# Altium schematic sheet 06 - SAMA7D65-DDR3L.SchDoc
size B; CompanyName: Microchip Technology Inc.; Organization: Microchip Technology; Address1: 2355 West Chandler Blvd.; Address2: Chandler, AZ  85224; Address4: USA; DocumentNumber: 6; SheetNumber: 6; SheetTotal: 15; SheetTitle: SAMA7D65 DDR3L
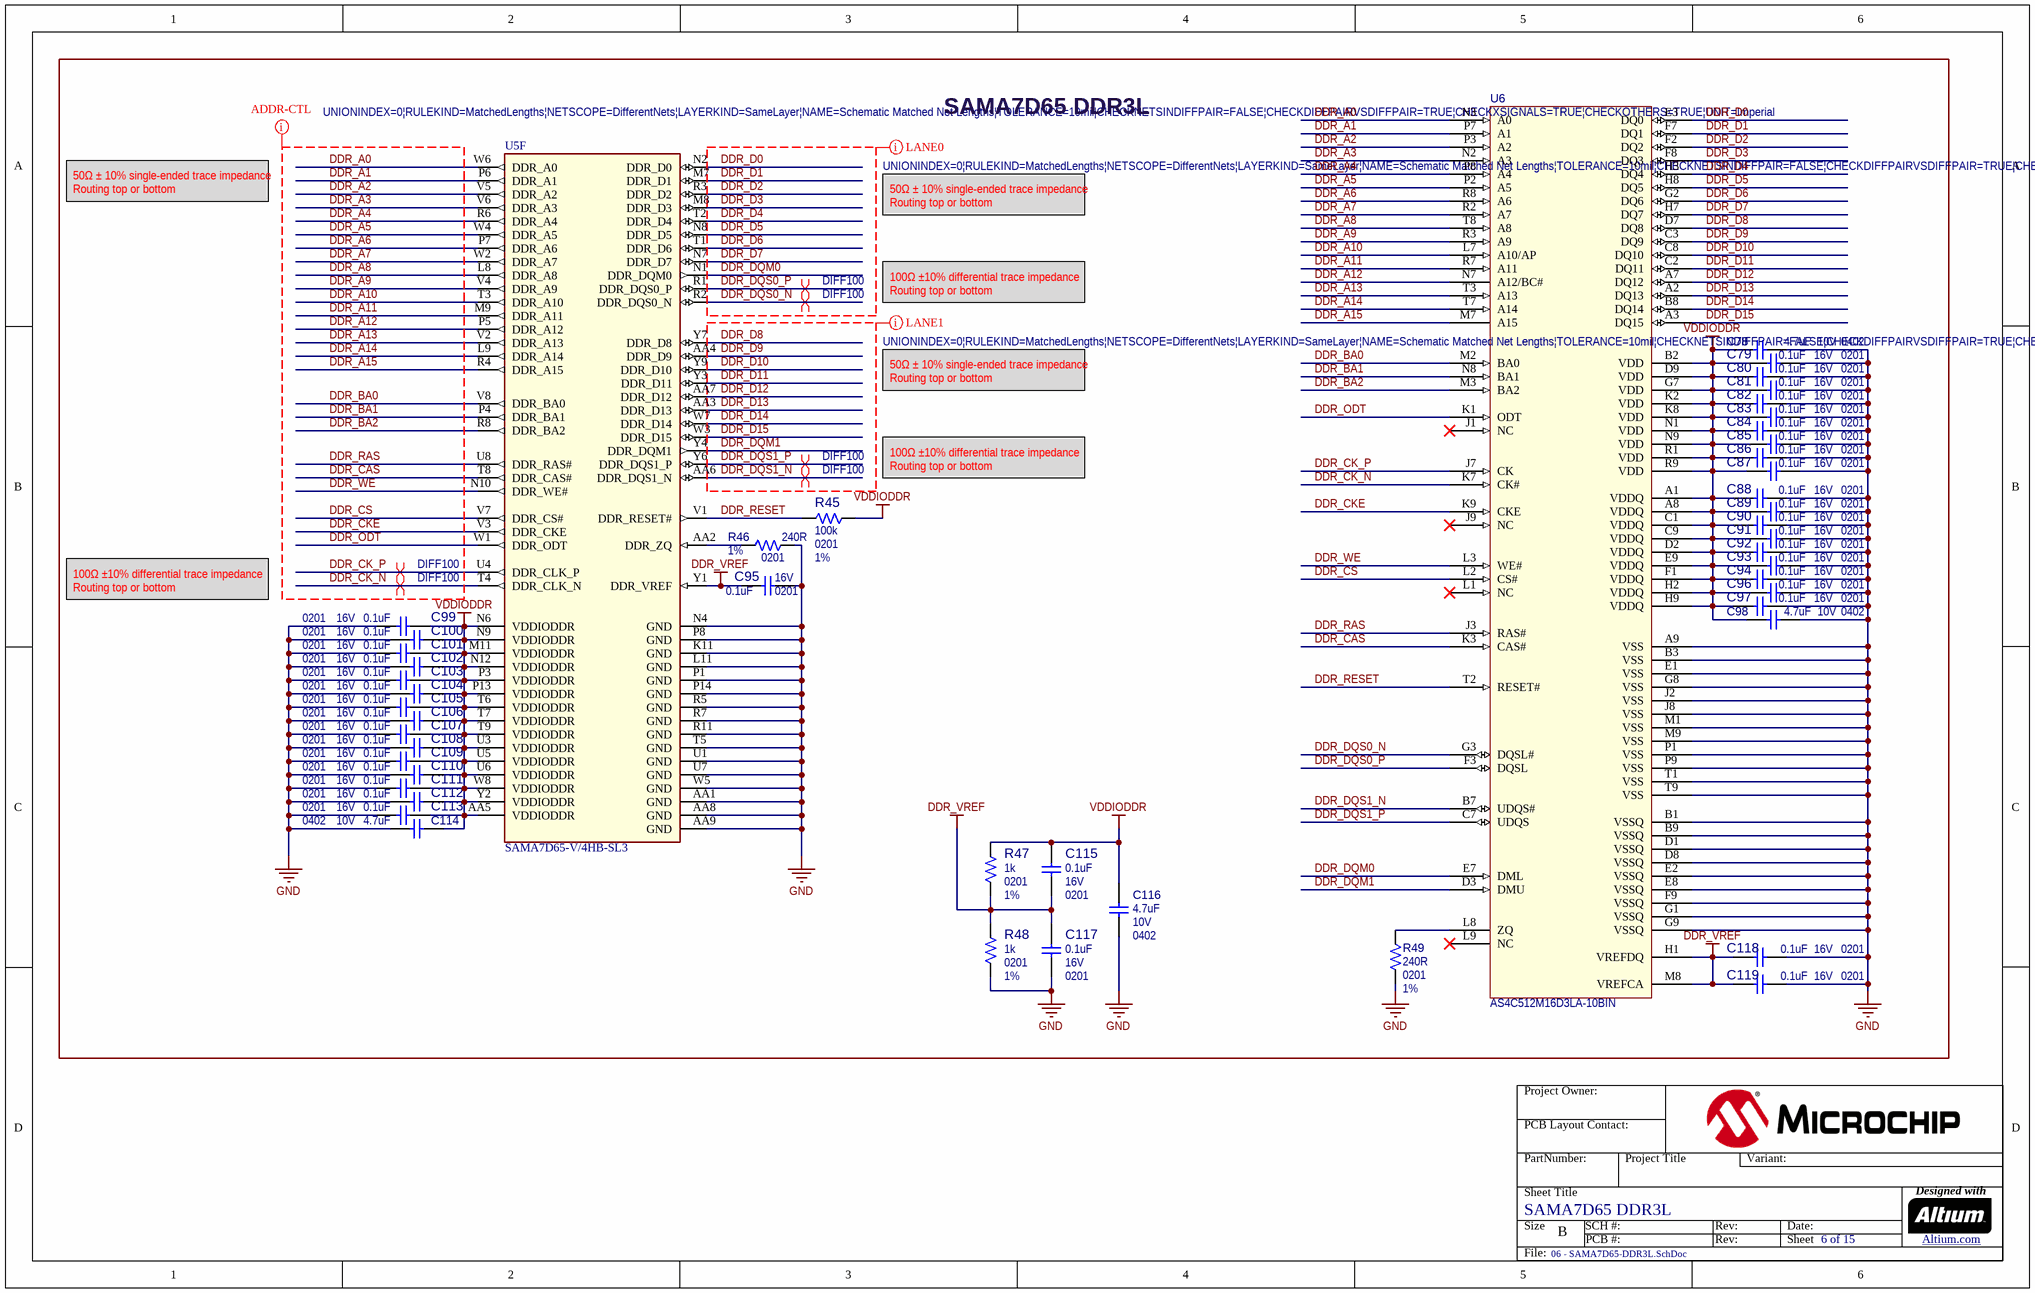
[diagram p0: 06 - SAMA7D65-DDR3L.SchDoc]

## Parts
C78  value 4.7uF  Voltage: 10V  Package: 0402  [CAP_C_0402]  (hidden comment: Capacitor NP)
C79  value 0.1uF  Voltage: 16V  Package: 0201  [CAP_C_0201]  (hidden comment: Capacitor NP)
C80  value 0.1uF  Voltage: 16V  Package: 0201  [CAP_C_0201]  (hidden comment: Capacitor NP)
C81  value 0.1uF  Voltage: 16V  Package: 0201  [CAP_C_0201]  (hidden comment: Capacitor NP)
C82  value 0.1uF  Voltage: 16V  Package: 0201  [CAP_C_0201]  (hidden comment: Capacitor NP)
C83  value 0.1uF  Voltage: 16V  Package: 0201  [CAP_C_0201]  (hidden comment: Capacitor NP)
C84  value 0.1uF  Voltage: 16V  Package: 0201  [CAP_C_0201]  (hidden comment: Capacitor NP)
C85  value 0.1uF  Voltage: 16V  Package: 0201  [CAP_C_0201]  (hidden comment: Capacitor NP)
C86  value 0.1uF  Voltage: 16V  Package: 0201  [CAP_C_0201]  (hidden comment: Capacitor NP)
C87  value 0.1uF  Voltage: 16V  Package: 0201  [CAP_C_0201]  (hidden comment: Capacitor NP)
C88  value 0.1uF  Voltage: 16V  Package: 0201  [CAP_C_0201]  (hidden comment: Capacitor NP)
C89  value 0.1uF  Voltage: 16V  Package: 0201  [CAP_C_0201]  (hidden comment: Capacitor NP)
C90  value 0.1uF  Voltage: 16V  Package: 0201  [CAP_C_0201]  (hidden comment: Capacitor NP)
C91  value 0.1uF  Voltage: 16V  Package: 0201  [CAP_C_0201]  (hidden comment: Capacitor NP)
C92  value 0.1uF  Voltage: 16V  Package: 0201  [CAP_C_0201]  (hidden comment: Capacitor NP)
C93  value 0.1uF  Voltage: 16V  Package: 0201  [CAP_C_0201]  (hidden comment: Capacitor NP)
C94  value 0.1uF  Voltage: 16V  Package: 0201  [CAP_C_0201]  (hidden comment: Capacitor NP)
C95  value 0.1uF  Voltage: 16V  Package: 0201  [CAP_C_0201]  (hidden comment: Capacitor NP)
C96  value 0.1uF  Voltage: 16V  Package: 0201  [CAP_C_0201]  (hidden comment: Capacitor NP)
C97  value 0.1uF  Voltage: 16V  Package: 0201  [CAP_C_0201]  (hidden comment: Capacitor NP)
C98  value 4.7uF  Voltage: 10V  Package: 0402  [CAP_C_0402]  (hidden comment: Capacitor NP)
C99  value 0.1uF  Voltage: 16V  Package: 0201  [CAP_C_0201]  (hidden comment: Capacitor NP)
C100  value 0.1uF  Voltage: 16V  Package: 0201  [CAP_C_0201]  (hidden comment: Capacitor NP)
C101  value 0.1uF  Voltage: 16V  Package: 0201  [CAP_C_0201]  (hidden comment: Capacitor NP)
C102  value 0.1uF  Voltage: 16V  Package: 0201  [CAP_C_0201]  (hidden comment: Capacitor NP)
C103  value 0.1uF  Voltage: 16V  Package: 0201  [CAP_C_0201]  (hidden comment: Capacitor NP)
C104  value 0.1uF  Voltage: 16V  Package: 0201  [CAP_C_0201]  (hidden comment: Capacitor NP)
C105  value 0.1uF  Voltage: 16V  Package: 0201  [CAP_C_0201]  (hidden comment: Capacitor NP)
C106  value 0.1uF  Voltage: 16V  Package: 0201  [CAP_C_0201]  (hidden comment: Capacitor NP)
C107  value 0.1uF  Voltage: 16V  Package: 0201  [CAP_C_0201]  (hidden comment: Capacitor NP)
C108  value 0.1uF  Voltage: 16V  Package: 0201  [CAP_C_0201]  (hidden comment: Capacitor NP)
C109  value 0.1uF  Voltage: 16V  Package: 0201  [CAP_C_0201]  (hidden comment: Capacitor NP)
C110  value 0.1uF  Voltage: 16V  Package: 0201  [CAP_C_0201]  (hidden comment: Capacitor NP)
C111  value 0.1uF  Voltage: 16V  Package: 0201  [CAP_C_0201]  (hidden comment: Capacitor NP)
C112  value 0.1uF  Voltage: 16V  Package: 0201  [CAP_C_0201]  (hidden comment: Capacitor NP)
C113  value 0.1uF  Voltage: 16V  Package: 0201  [CAP_C_0201]  (hidden comment: Capacitor NP)
C114  value 4.7uF  Voltage: 10V  Package: 0402  [CAP_C_0402]  (hidden comment: Capacitor NP)
C115  value 0.1uF  Voltage: 16V  Package: 0201  [CAP_C_0201]  (hidden comment: Capacitor NP)
C116  value 4.7uF  Voltage: 10V  Package: 0402  [CAP_C_0402]  (hidden comment: Capacitor NP)
C117  value 0.1uF  Voltage: 16V  Package: 0201  [CAP_C_0201]  (hidden comment: Capacitor NP)
C118  value 0.1uF  Voltage: 16V  Package: 0201  [CAP_C_0201]  (hidden comment: Capacitor NP)
C119  value 0.1uF  Voltage: 16V  Package: 0201  [CAP_C_0201]  (hidden comment: Capacitor NP)
R45  value 100k  Package: 0201  Tolerance: 1%  [RES_C_0201]  (hidden comment: Resistor)
R46  value 240R  Package: 0201  Tolerance: 1%  [RES_C_0201]  (hidden comment: Resistor)
R47  value 1k  Package: 0201  Tolerance: 1%  [RES_C_0201]  (hidden comment: Resistor)
R48  value 1k  Package: 0201  Tolerance: 1%  [RES_C_0201]  (hidden comment: Resistor)
R49  value 240R  Package: 0201  Tolerance: 1%  [RES_C_0201]  (hidden comment: Resistor)
U5  value SAMA7D65-V/4HB-SL3  [TFBGA-343_14x14]  (hidden comment: SAMA7D65)  (part F of 8)
U6  value AS4C512M16D3LA-10BIN  [TFBGA-96_13.5x9]  (hidden comment: AS4C512M16D3LA-10BIN TFBGA-96)

## Blocks framed on the sheet
SAMA7D65 DDR3L: C78-C119 R45-R49 U5 U6

## Nets
DDR_VREF: C95.1 C115.2 C117.1 C118.1 C119.1 R47.1 R48.2 U5.Y1(DDR_VREF) U6.H1(VREFDQ) U6.M8(VREFCA)
GND: C78.1 C79.2 C80.2 C81.2 C82.2 C83.2 C84.2 C85.2 C86.2 C87.2 C88.2 C89.2 C90.2 C91.2 C92.2 C93.2 C94.2 C95.2 C96.2 C97.2 C98.1 C99.2 C100.2 C101.2 C102.2 C103.2 C104.2 C105.2 C106.2 C107.2 C108.2 C109.2 C110.2 C111.2 C112.2 C113.2 C114.2 C116.1 C117.2 C118.2 C119.2 R46.2 R48.1 R49.1 U5.AA1(GND) U5.AA8(GND) U5.AA9(GND) U5.K11(GND) U5.L11(GND) U5.N4(GND) U5.P1(GND) U5.P8(GND) U5.P14(GND) U5.R5(GND) U5.R7(GND) U5.R11(GND) U5.T5(GND) U5.U1(GND) U5.U7(GND) U5.W5(GND) U6.A9(VSS) U6.B1(VSSQ) U6.B3(VSS) U6.B9(VSSQ) U6.D1(VSSQ) U6.D8(VSSQ) U6.E1(VSS) U6.E2(VSSQ) U6.E8(VSSQ) U6.F9(VSSQ) U6.G1(VSSQ) U6.G8(VSS) U6.G9(VSSQ) U6.J2(VSS) U6.J8(VSS) U6.M1(VSS) U6.M9(VSS) U6.P1(VSS) U6.P9(VSS) U6.T1(VSS) U6.T9(VSS)
VDDIODDR: C78.2 C79.1 C80.1 C81.1 C82.1 C83.1 C84.1 C85.1 C86.1 C87.1 C88.1 C89.1 C90.1 C91.1 C92.1 C93.1 C94.1 C96.1 C97.1 C98.2 C99.1 C100.1 C101.1 C102.1 C103.1 C104.1 C105.1 C106.1 C107.1 C108.1 C109.1 C110.1 C111.1 C112.1 C113.1 C114.1 C115.1 C116.2 R45.2 R47.2 U5.AA5(VDDIODDR) U5.M11(VDDIODDR) U5.N6(VDDIODDR) U5.N9(VDDIODDR) U5.N12(VDDIODDR) U5.P3(VDDIODDR) U5.P13(VDDIODDR) U5.T6(VDDIODDR) U5.T7(VDDIODDR) U5.T9(VDDIODDR) U5.U3(VDDIODDR) U5.U5(VDDIODDR) U5.U6(VDDIODDR) U5.W8(VDDIODDR) U5.Y2(VDDIODDR) U6.A1(VDDQ) U6.A8(VDDQ) U6.B2(VDD) U6.C1(VDDQ) U6.C9(VDDQ) U6.D2(VDDQ) U6.D9(VDD) U6.E9(VDDQ) U6.F1(VDDQ) U6.G7(VDD) U6.H2(VDDQ) U6.H9(VDDQ) U6.K2(VDD) U6.K8(VDD) U6.N1(VDD) U6.N9(VDD) U6.R1(VDD) U6.R9(VDD)
DDR_A0: U5.W6(DDR_A0) U6.N3(A0)
DDR_A1: U5.P6(DDR_A1) U6.P7(A1)
DDR_A2: U5.V5(DDR_A2) U6.P3(A2)
DDR_A3: U5.V6(DDR_A3) U6.N2(A3)
DDR_A4: U5.R6(DDR_A4) U6.P8(A4)
DDR_A5: U5.W4(DDR_A5) U6.P2(A5)
DDR_A6: U5.P7(DDR_A6) U6.R8(A6)
DDR_A7: U5.W2(DDR_A7) U6.R2(A7)
DDR_A8: U5.L8(DDR_A8) U6.T8(A8)
DDR_A9: U5.V4(DDR_A9) U6.R3(A9)
DDR_A10: U5.T3(DDR_A10) U6.L7(A10/AP)
DDR_A11: U5.M9(DDR_A11) U6.R7(A11)
DDR_A12: U5.P5(DDR_A12) U6.N7(A12/BC#)
DDR_A13: U5.V2(DDR_A13) U6.T3(A13)
DDR_A14: U5.L9(DDR_A14) U6.T7(A14)
DDR_A15: U5.R4(DDR_A15) U6.M7(A15)
DDR_BA0: U5.V8(DDR_BA0) U6.M2(BA0)
DDR_BA1: U5.P4(DDR_BA1) U6.N8(BA1)
DDR_BA2: U5.R8(DDR_BA2) U6.M3(BA2)
DDR_CAS: U5.T8(DDR_CAS#) U6.K3(CAS#)
DDR_CK_N: U5.T4(DDR_CLK_N) U6.K7(CK#)
DDR_CK_P: U5.U4(DDR_CLK_P) U6.J7(CK)
DDR_CKE: U5.V3(DDR_CKE) U6.K9(CKE)
DDR_CS: U5.V7(DDR_CS#) U6.L2(CS#)
DDR_D0: U5.N2(DDR_D0) U6.E3(DQ0)
DDR_D1: U5.M7(DDR_D1) U6.F7(DQ1)
DDR_D2: U5.R3(DDR_D2) U6.F2(DQ2)
DDR_D3: U5.M8(DDR_D3) U6.F8(DQ3)
DDR_D4: U5.T2(DDR_D4) U6.H3(DQ4)
DDR_D5: U5.N8(DDR_D5) U6.H8(DQ5)
DDR_D6: U5.T1(DDR_D6) U6.G2(DQ6)
DDR_D7: U5.N7(DDR_D7) U6.H7(DQ7)
DDR_D8: U5.Y7(DDR_D8) U6.D7(DQ8)
DDR_D9: U5.AA4(DDR_D9) U6.C3(DQ9)
DDR_D10: U5.Y9(DDR_D10) U6.C8(DQ10)
DDR_D11: U5.Y3(DDR_D11) U6.C2(DQ11)
DDR_D12: U5.AA7(DDR_D12) U6.A7(DQ12)
DDR_D13: U5.AA3(DDR_D13) U6.A2(DQ13)
DDR_D14: U5.W7(DDR_D14) U6.B8(DQ14)
DDR_D15: U5.W3(DDR_D15) U6.A3(DQ15)
DDR_DQM0: U5.N1(DDR_DQM0) U6.E7(DML)
DDR_DQM1: U5.Y4(DDR_DQM1) U6.D3(DMU)
DDR_DQS0_N: U5.R2(DDR_DQS0_N) U6.G3(DQSL#)
DDR_DQS0_P: U5.R1(DDR_DQS0_P) U6.F3(DQSL)
DDR_DQS1_N: U5.AA6(DDR_DQS1_N) U6.B7(UDQS#)
DDR_DQS1_P: U5.Y6(DDR_DQS1_P) U6.C7(UDQS)
DDR_ODT: U5.W1(DDR_ODT) U6.K1(ODT)
DDR_RAS: U5.U8(DDR_RAS#) U6.J3(RAS#)
DDR_RESET: R45.1 U5.V1(DDR_RESET#) U6.T2(RESET#)
DDR_WE: U5.N10(DDR_WE#) U6.L3(WE#)
NetR46_1: R46.1 U5.AA2(DDR_ZQ)
NetR49_2: R49.2 U6.L8(ZQ)

Not connected (* = marked no-connect by the designer): U6 J1(NC)* J9(NC)* L1(NC)* L9(NC)*

## Layout directives
net class DDR-ADDR-CTL; rule Matched Net Lengths [Tolerance = 10mil]: DDR_A0, DDR_A1, DDR_A2, DDR_A3, DDR_A4, DDR_A5, DDR_A6, DDR_A7, DDR_A8, DDR_A9, DDR_A10, DDR_A11, DDR_A12, DDR_A13, DDR_A14, DDR_A15, DDR_BA0, DDR_BA1, DDR_BA2, DDR_CAS, DDR_CK_N, DDR_CK_P, DDR_CKE, DDR_CS, DDR_ODT, DDR_RAS, DDR_WE
differential pair; differential pair class DIFF100; net class DIFF100; rule Matched Net Lengths [Tolerance = 4mil]: DDR_CK_N, DDR_CK_P, DDR_DQS0_N, DDR_DQS0_P, DDR_DQS1_N, DDR_DQS1_P
net class DDR-LANE0; rule Matched Net Lengths [Tolerance = 10mil]: DDR_D0, DDR_D1, DDR_D2, DDR_D3, DDR_D4, DDR_D5, DDR_D6, DDR_D7, DDR_DQM0, DDR_DQS0_N, DDR_DQS0_P
net class DDR-LANE1; rule Matched Net Lengths [Tolerance = 10mil]: DDR_D8, DDR_D9, DDR_D10, DDR_D11, DDR_D12, DDR_D13, DDR_D14, DDR_D15, DDR_DQM1, DDR_DQS1_N, DDR_DQS1_P

## Notes on the sheet
- 50Ω ± 10% single-ended trace impedance
  Routing top or bottom
- 100Ω ±10% differential trace impedance
  Routing top or bottom
- Project Owner:
- PCB Layout Contact:
- PartNumber:
- Project Title
- Variant:
- Sheet Title
- Size
- B
- SCH #:
- PCB #:
- Rev:
- Date:
- Sheet
- Designed with
- Altium.com <http://go.altium.com/MicrochipLandingPage_Evaluation.html>
- File:

## Library data of the parts
C78 C98 C114 C116 = CAP1684: Capacitor; Manufacturer 1: TDK Corporation; Manufacturer Part Number 1: C1005X5R1A475K050BC; Description_: CAP CER 4.7uF 10V 10% X5R SMD 0402; Dev Tools Status: Production; Tolerance: 10%; Temperature Coeffcient: X5R; Type: Ceramic; Owner: Jesus Aviles; Populated: YES; MCHP-ID: CAP1684; Revision: 1; Symbol: Capacitor NP; Status: MCL Design; ComponentLink1Description: SVN Datasheet; ComponentLink2Description: Local Datasheet; ComponentLink3URL: C:\ALTIUM_WORK\00001_MCHP-CDB\Library\LibraryRefs\Capacitor NP.SchLib; ComponentLink3Description: Open Symbol; ComponentLink4URL: C:\ALTIUM_WORK\00001_MCHP-CDB\Library\Footprints\CAP_C_0402.PcbLib; ComponentLink4Description: Open Footprint; ComponentLink5Description: Open Footprint 2; ComponentLink6Description: Open Footprint 3; ComponentLink7Description: Open Footprint 4; Operating Temperature: -55C to 85C; Category: Capacitor; Supplier 1: Digi-Key; Supplier Part Number 1: 445-13820-1-ND; Quantity Override: 1
C79-C97 C99-C113 C115 C117-C119 = CAP1978: Manufacturer 1: D3_Murata Electronics; Manufacturer Part Number 1: GRM033C71C104KE14J; Description_: CAP CER 0.1uF 16V 10% X7S 0201; Dev Tools Status: Production; Tolerance: 10%; Owner: Dragos Danaila; Populated: YES; Temperature Coefficient: X7S; Restricted Sourcing: No; MCHP-ID: CAP1978; Revision: 2; Symbol: Capacitor NP; Status: MCL Design; ComponentLink1URL: https://chn-vm-apps.microchip.com/mchprepo/parts/Datasheets/GRM033C71C104KE14-01.pdf; ComponentLink1Description: SVN Datasheet; ComponentLink2URL: C:\ALTIUM_WORK\00001_MCHP-CDB\Datasheets\GRM033C71C104KE14-01.pdf; ComponentLink2Description: Local Datasheet; ComponentLink3URL: C:\ALTIUM_WORK\00001_MCHP-CDB\Library\LibraryRefs\Capacitor NP.SchLib; ComponentLink3Description: Open Symbol; ComponentLink4URL: C:\ALTIUM_WORK\00001_MCHP-CDB\Library\Footprints\CAP_C_0201.PcbLib; ComponentLink4Description: Open Footprint; ComponentLink5Description: Open Footprint 2; ComponentLink6Description: Open Footprint 3; ComponentLink7Description: Open Footprint 4; Operating Temperature: -55C to +125C; Category: Capacitor; Supplier 1: Mouser; Supplier Part Number 1: 81-GRM033C71C104KE4J; Quantity Override: 1; Manufacturer 2: D3_Murata Electronics; Manufacturer Part Number 2: GRM033C71C104KE14E; Manufacturer 3: Murata; Manufacturer Part Number 3: GRM033C71C104KE14D; Supplier 2: Mouser; Supplier Part Number 2: 81-GRM033C71C104KE4E; Supplier 3: Digi-Key; Supplier Part Number 3: 490-10387-1-ND
R45 = RSMT1356: Manufacturer 1: Stackpole Electronics Inc; Manufacturer Part Number 1: RMCF0201FT100K; Description_: RES TKF 100k 1% 1/20W SMD 0201; Dev Tools Status: Production; Voltage: 25V; Power: 1/20W; Owner: Ciprian Abramov; Populated: YES; Temperature Coefficient: 200ppm/C; Restricted Sourcing: No; MCHP-ID: RSMT1356; Revision: 2; Symbol: Resistor; Status: MCL Design; ComponentLink1URL: https://chn-vm-apps.microchip.com/mchprepo/parts/Datasheets/sei-rmcf_rmcp.pdf; ComponentLink1Description: SVN Datasheet; ComponentLink2URL: C:\ALTIUM_WORK\00001_MCHP-CDB\Datasheets\sei-rmcf_rmcp.pdf; ComponentLink2Description: Local Datasheet; ComponentLink3URL: C:\ALTIUM_WORK\00001_MCHP-CDB\Library\LibraryRefs\Resistor.SchLib; ComponentLink3Description: Open Symbol; ComponentLink4URL: C:\ALTIUM_WORK\00001_MCHP-CDB\Library\Footprints\RES_C_0201.PcbLib; ComponentLink4Description: Open Footprint; ComponentLink5Description: Open Footprint 2; ComponentLink6Description: Open Footprint 3; ComponentLink7Description: Open Footprint 4; Operating Temperature: -55C to +125C; Category: Resistor; Type: RES SMD; Composition: TKF; Supplier 1: Digi-Key; Supplier Part Number 1: RMCF0201FT100KCT-ND; Quantity Override: 1
R46 R49 = RSMT1249: Manufacturer 1: Yageo; Manufacturer Part Number 1: RC0201FR-07240RL; Description_: RES TKF 240R 1% 1/20W SMD 0201; Dev Tools Status: Production; Voltage: 25V; Temperature Coefficient: 200ppm; Current: 0.5A; Power: 1/20W; Owner: Dragos Danaila; Populated: YES; MCHP-ID: RSMT1249; Revision: 1; Symbol: Resistor; Status: MCL Design; ComponentLink1URL: https://chn-vm-apps.microchip.com/mchprepo/parts/Datasheets/PYu-RC_Group_51_RoHS_L_9.pdf; ComponentLink1Description: SVN Datasheet; ComponentLink2URL: C:\ALTIUM_WORK\00001_MCHP-CDB\Datasheets\PYu-RC_Group_51_RoHS_L_9.pdf; ComponentLink2Description: Local Datasheet; ComponentLink3URL: C:\ALTIUM_WORK\00001_MCHP-CDB\Library\LibraryRefs\Resistor.SchLib; ComponentLink3Description: Open Symbol; ComponentLink4URL: C:\ALTIUM_WORK\00001_MCHP-CDB\Library\Footprints\RES_C_0201.PcbLib; ComponentLink4Description: Open Footprint; ComponentLink5Description: Open Footprint 2; ComponentLink6Description: Open Footprint 3; ComponentLink7Description: Open Footprint 4; Operating Temperature: -55C to +125C; Category: Resistor; Type: RES SMD; Composition: TKF; Supplier 1: Digi-Key; Supplier Part Number 1: YAG2528CT-ND; Quantity Override: 1
R47 R48 = RES1588: Manufacturer 1: Vishay; Manufacturer Part Number 1: CRCW02011K00FNED; Description_: RES TKF 1k 1% 1/20W SMD 0201; Dev Tools Status: Production; Voltage: 25V; Power: 1/20W; Owner: Gabor Bihari; Populated: YES; MCHP-ID: RES1588; Revision: 3; Symbol: Resistor; Status: MCL Design; ComponentLink1URL: https://chn-vm-apps.microchip.com/mchprepo/parts/Datasheets/ERJ_G,R,E_Rev08.pdf; ComponentLink1Description: SVN Datasheet; ComponentLink2URL: C:\ALTIUM_WORK\00001_MCHP-CDB\Datasheets\ERJ_G,R,E_Rev08.pdf; ComponentLink2Description: Local Datasheet; ComponentLink3URL: C:\ALTIUM_WORK\00001_MCHP-CDB\Library\LibraryRefs\Resistor.SchLib; ComponentLink3Description: Open Symbol; ComponentLink4URL: C:\ALTIUM_WORK\00001_MCHP-CDB\Library\Footprints\RES_C_0201.PcbLib; ComponentLink4Description: Open Footprint; ComponentLink5Description: Open Footprint 2; ComponentLink6Description: Open Footprint 3; ComponentLink7Description: Open Footprint 4; Operating Temperature: -55°C to 125°C; Category: Resistor; Type: RES SMD; Composition: TKF; Supplier 1: Digi-Key; Supplier Part Number 1: 541-1.00KABTR-ND; Quantity Override: 1
U5 = IC2674: SAMA7D65 MPU 1000MHz Cortex-A7 TFBGA-343; Manufacturer 1: Microchip Technology; MCHP-ID: IC2674; Description_: MCHP MPU 32-BIT Cortex-A7 1000MHz 128kB SAMA7D65-V/4HB-SL3 TFBGA-343; Dev Tools Status: Design; Owner: Ciprian Abramov; Populated: YES; Restricted Sourcing: No; Symbol: SAMA7D65-TFBGA-343; Type: 32-Bit MPU; Status: MCL Design; Revision: 1; Category: MCHP-Microcontroller; ComponentLink1URL: https://www.microchip.com/sitesearch/search/Product%20and%20Development%20Tools/SAMA7D65-V/4HB-SL3; ComponentLink1Description: SVN Datasheet; ComponentLink2Description: Local Datasheet; ComponentLink3URL: C:\ALTIUM_WORK\00001_MCHP-CDB\Library\LibraryRefs\SAMA7D65-TFBGA-343.SchLib; ComponentLink3Description: Open Symbol; ComponentLink4URL: C:\ALTIUM_WORK\00001_MCHP-CDB\Library\Footprints\TFBGA-343_14x14.PcbLib; ComponentLink4Description: Open Footprint; ComponentLink5Description: Open Footprint 2; ComponentLink6Description: Open Footprint 3; ComponentLink7Description: Open Footprint 4; Manufacturer Part Number 1: SAMA7D65-V/4HB-SL3; Supplier 1: Microchip Technology; Supplier Part Number 1: SAMA7D65-V/4HB-SL3; Operating Temperature: -40C to +105C; Quantity Override: 1
U6 = IC1748: 8Gb DDR3L-1866 SDRAM, 512Mb x 16, -40C to +95C; Manufacturer 1: Alliance Memory, Inc.; MCHP-ID: IC1748; Description_: IC MEMORY AS4C512M16D3LA-10BIN DDR3L 8Gb 933MHz FBGA-96; Dev Tools Status: Design; Vin: 1.35V; Owner: Ciprian Abramov; Populated: YES; Restricted Sourcing: No; Revision: 1; Symbol: AS4C512M16D3LA-10BIN TFBGA-96; Status: MCL Design; Package: TFBGA-96; ComponentLink1URL: https://chn-vm-apps.microchip.com/mchprepo/parts/Datasheets/AllianceMemory_DDR3L_8G_AS4C512M16D3LA-10BCN-BIN-BAN_Feb2019_v1.0.pdf; ComponentLink1Description: SVN Datasheet; ComponentLink2URL: C:\ALTIUM_WORK\00001_MCHP-CDB\Datasheets\AllianceMemory_DDR3L_8G_AS4C512M16D3LA-10BCN-BIN-BAN_Feb2019_v1.0.pdf; ComponentLink2Description: Local Datasheet; ComponentLink3URL: C:\ALTIUM_WORK\00001_MCHP-CDB\Library\LibraryRefs\AS4C512M16D3LA-10BIN TFBGA-96.SchLib; ComponentLink3Description: Open Symbol; ComponentLink4URL: C:\ALTIUM_WORK\00001_MCHP-CDB\Library\Footprints\TFBGA-96_13.5x9.PcbLib; ComponentLink4Description: Open Footprint; ComponentLink5Description: Open Footprint 2; ComponentLink6Description: Open Footprint 3; ComponentLink7Description: Open Footprint 4; Operating Temperature: -40C to +95C; Type: Memory; Category: IC; Manufacturer Part Number 1: AS4C512M16D3LA-10BIN; Supplier 1: Digi-Key; Supplier Part Number 1: 1450-1488-ND; Quantity Override: 1